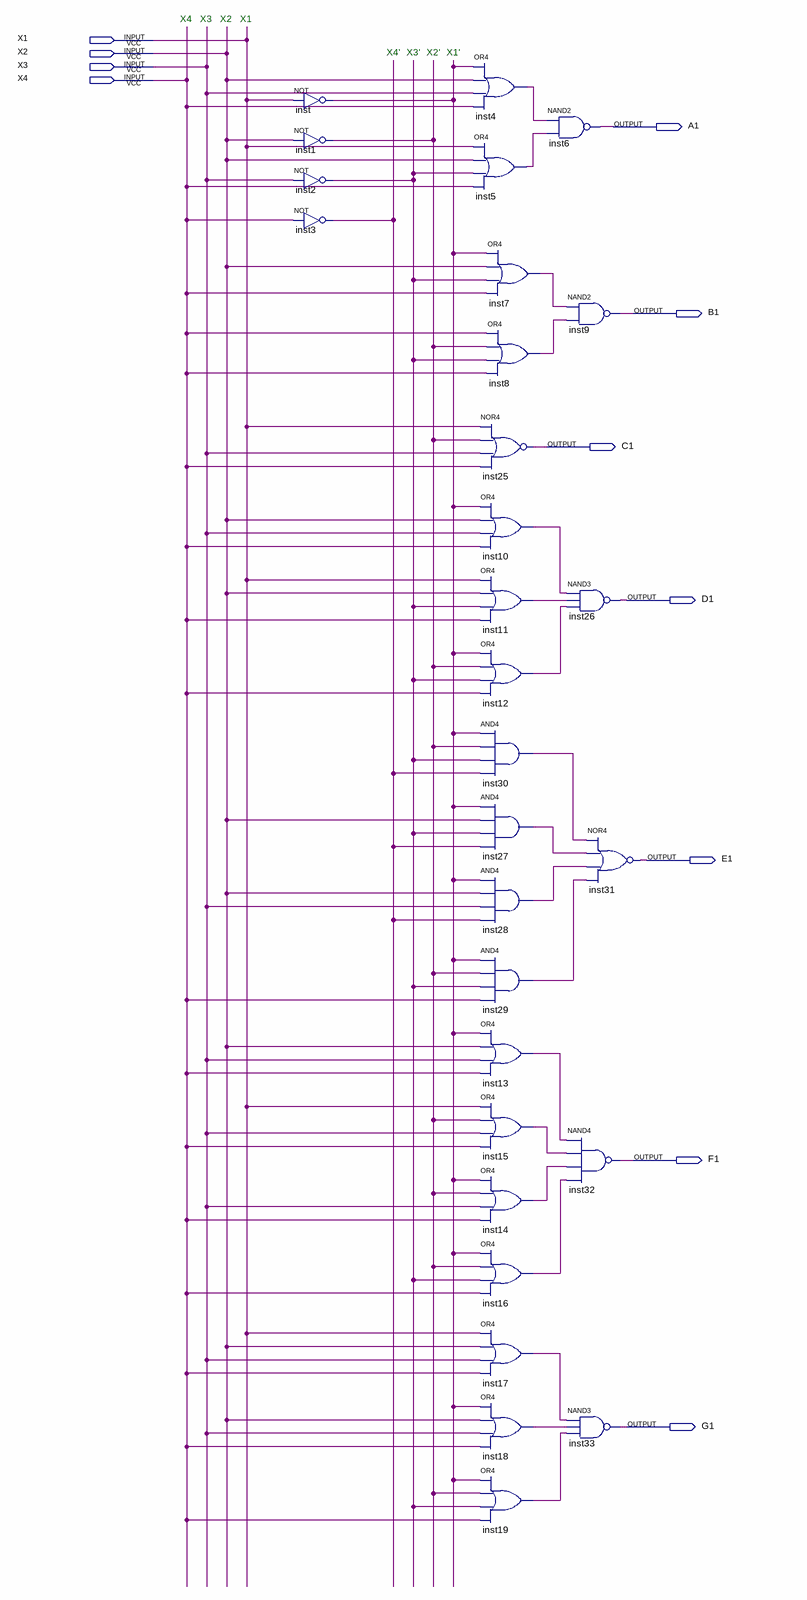
[diagram p0: schematic sheet]
// Quartus schematic Indicator1.bdf as structural Verilog: 29 symbols, 11 pins
module Indicator1 (
  input  X1,
  input  X2,
  input  X3,
  input  X4,
  output A1,
  output B1,
  output C1,
  output D1,
  output E1,
  output F1,
  output G1
);

  wire inst1_out, inst2_out, inst3_out, inst4_out, inst5_out, inst7_out, inst8_out, inst10_out, inst11_out,
       inst12_out, inst13_out, inst14_out, inst15_out, inst16_out, inst17_out, inst18_out, inst19_out,
       inst27_out, inst28_out, inst29_out, inst30_out, inst_out;

  not inst (inst_out, X1);
  not inst1 (inst1_out, X2);
  not inst2 (inst2_out, X3);
  not inst3 (inst3_out, X4);
  or inst4 (inst4_out, inst_out, X2, X3, X4);
  or inst5 (inst5_out, X1, X2, inst2_out, X4);
  or inst7 (inst7_out, inst_out, X2, inst2_out, X4);
  or inst8 (inst8_out, X4, inst1_out, inst2_out, X4);
  nor inst25 (C1, X1, inst1_out, X3, X4);
  or inst10 (inst10_out, inst_out, X2, X3, X4);
  or inst11 (inst11_out, X1, X2, inst2_out, X4);
  or inst12 (inst12_out, inst_out, inst1_out, inst2_out, X4);
  and inst30 (inst30_out, inst_out, inst1_out, inst2_out, inst3_out);
  and inst27 (inst27_out, inst_out, X2, inst2_out, inst3_out);
  and inst28 (inst28_out, inst_out, X2, X3, inst3_out);
  and inst29 (inst29_out, inst_out, inst1_out, inst2_out, X4);
  or inst13 (inst13_out, inst_out, X2, X3, X4);
  or inst15 (inst15_out, X1, inst1_out, X3, X4);
  or inst14 (inst14_out, inst_out, inst1_out, X3, X4);
  or inst16 (inst16_out, inst_out, inst1_out, inst2_out, X4);
  or inst17 (inst17_out, X1, X2, X3, X4);
  or inst18 (inst18_out, inst_out, X2, X3, X4);
  or inst19 (inst19_out, inst_out, inst1_out, inst2_out, X4);
  nand inst6 (A1, inst4_out, inst5_out);
  nand inst9 (B1, inst7_out, inst8_out);
  nand inst26 (D1, inst10_out, inst11_out, inst12_out);
  nor inst31 (E1, inst30_out, inst27_out, inst28_out, inst29_out);
  nand inst32 (F1, inst13_out, inst15_out, inst14_out, inst16_out);
  nand inst33 (G1, inst17_out, inst18_out, inst19_out);

  // Notes on the sheet:
  //   X4
  //   X3
  //   X2
  //   X1
  //   X4'
  //   X3'
  //   X2'
  //   X1'
endmodule
